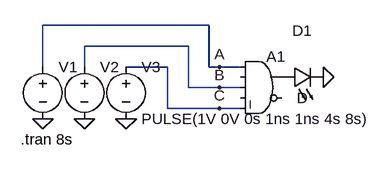
[diagram p0: schematic Draft3.asc]
Draft3.asc, the LTspice schematic file:
Version 4
SHEET 1 880 680
WIRE 16 32 -240 32
WIRE -16 64 -176 64
WIRE -240 96 -240 32
WIRE -176 96 -176 64
WIRE -48 96 -112 96
WIRE 16 96 16 32
WIRE 32 96 16 96
WIRE 64 96 32 96
WIRE -16 128 -16 64
WIRE 32 128 -16 128
WIRE 64 128 32 128
WIRE -48 160 -48 96
WIRE 32 160 -48 160
WIRE 64 160 32 160
FLAG -240 176 0
FLAG -176 176 0
FLAG -112 176 0
FLAG 32 96 A
FLAG 32 128 B
FLAG 32 160 C
FLAG 192 112 0
SYMBOL Digital\\and 96 64 R0
SYMATTR InstName A1
SYMBOL voltage -240 80 R0
WINDOW 3 24 96 Invisible 2
WINDOW 123 0 0 Left 0
WINDOW 39 0 0 Left 0
SYMATTR InstName V1
SYMATTR Value PULSE(1V 0V 0s 1ns 1ns 1s 2s)
SYMBOL voltage -176 80 R0
WINDOW 3 24 96 Invisible 2
WINDOW 123 0 0 Left 0
WINDOW 39 0 0 Left 0
SYMATTR InstName V2
SYMATTR Value PULSE(1V 0V 0s 1ns 1ns 2s 4s)
SYMBOL voltage -112 80 R0
WINDOW 123 0 0 Left 0
WINDOW 39 0 0 Left 0
SYMATTR InstName V3
SYMATTR Value PULSE(1V 0V 0s 1ns 1ns 4s 8s)
SYMBOL LED 128 128 R270
WINDOW 0 72 32 VTop 2
WINDOW 3 0 32 VBottom 2
SYMATTR InstName D1
TEXT -274 208 Left 2 !.tran 8s

The netlist it stands for:
* Draft3.asc
A1 A 0 B 0 C 0 P001 0 AND
V1 A 0 PULSE(1V 0V 0s 1ns 1ns 1s 2s)
V2 B 0 PULSE(1V 0V 0s 1ns 1ns 2s 4s)
V3 C 0 PULSE(1V 0V 0s 1ns 1ns 4s 8s)
D1 P001 0 D
.model D D
.lib standard.dio
.tran 8s
.backanno
.end

* Results of the author's LTspice run, read from the files saved beside the schematic
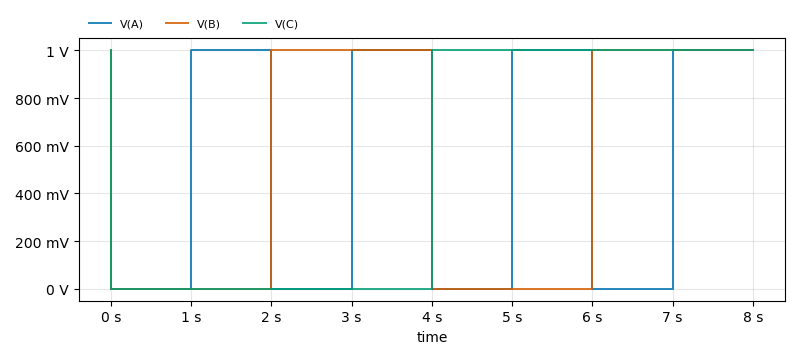
[diagram p1: Transient Analysis of Draft3.asc, plotted from the saved traces]
* Transient Analysis, 1 run:
*   V(A): min 0 V, max 1 V, average 500 mV, rms 707.1 mV, last 1 V
*   V(B): min 0 V, max 1 V, average 500 mV, rms 707.1 mV, last 1 V
*   V(C): min 0 V, max 1 V, average 500 mV, rms 707.1 mV, last 1 V